# EAGLE design training_board (EAGLE 9.6.2)
AUTHOR: Varun Madabushi; REVISION: 0.1; SCH_DESC: Arduino Motor Shield for 2019-20 Training; TEAM: Electrical Training
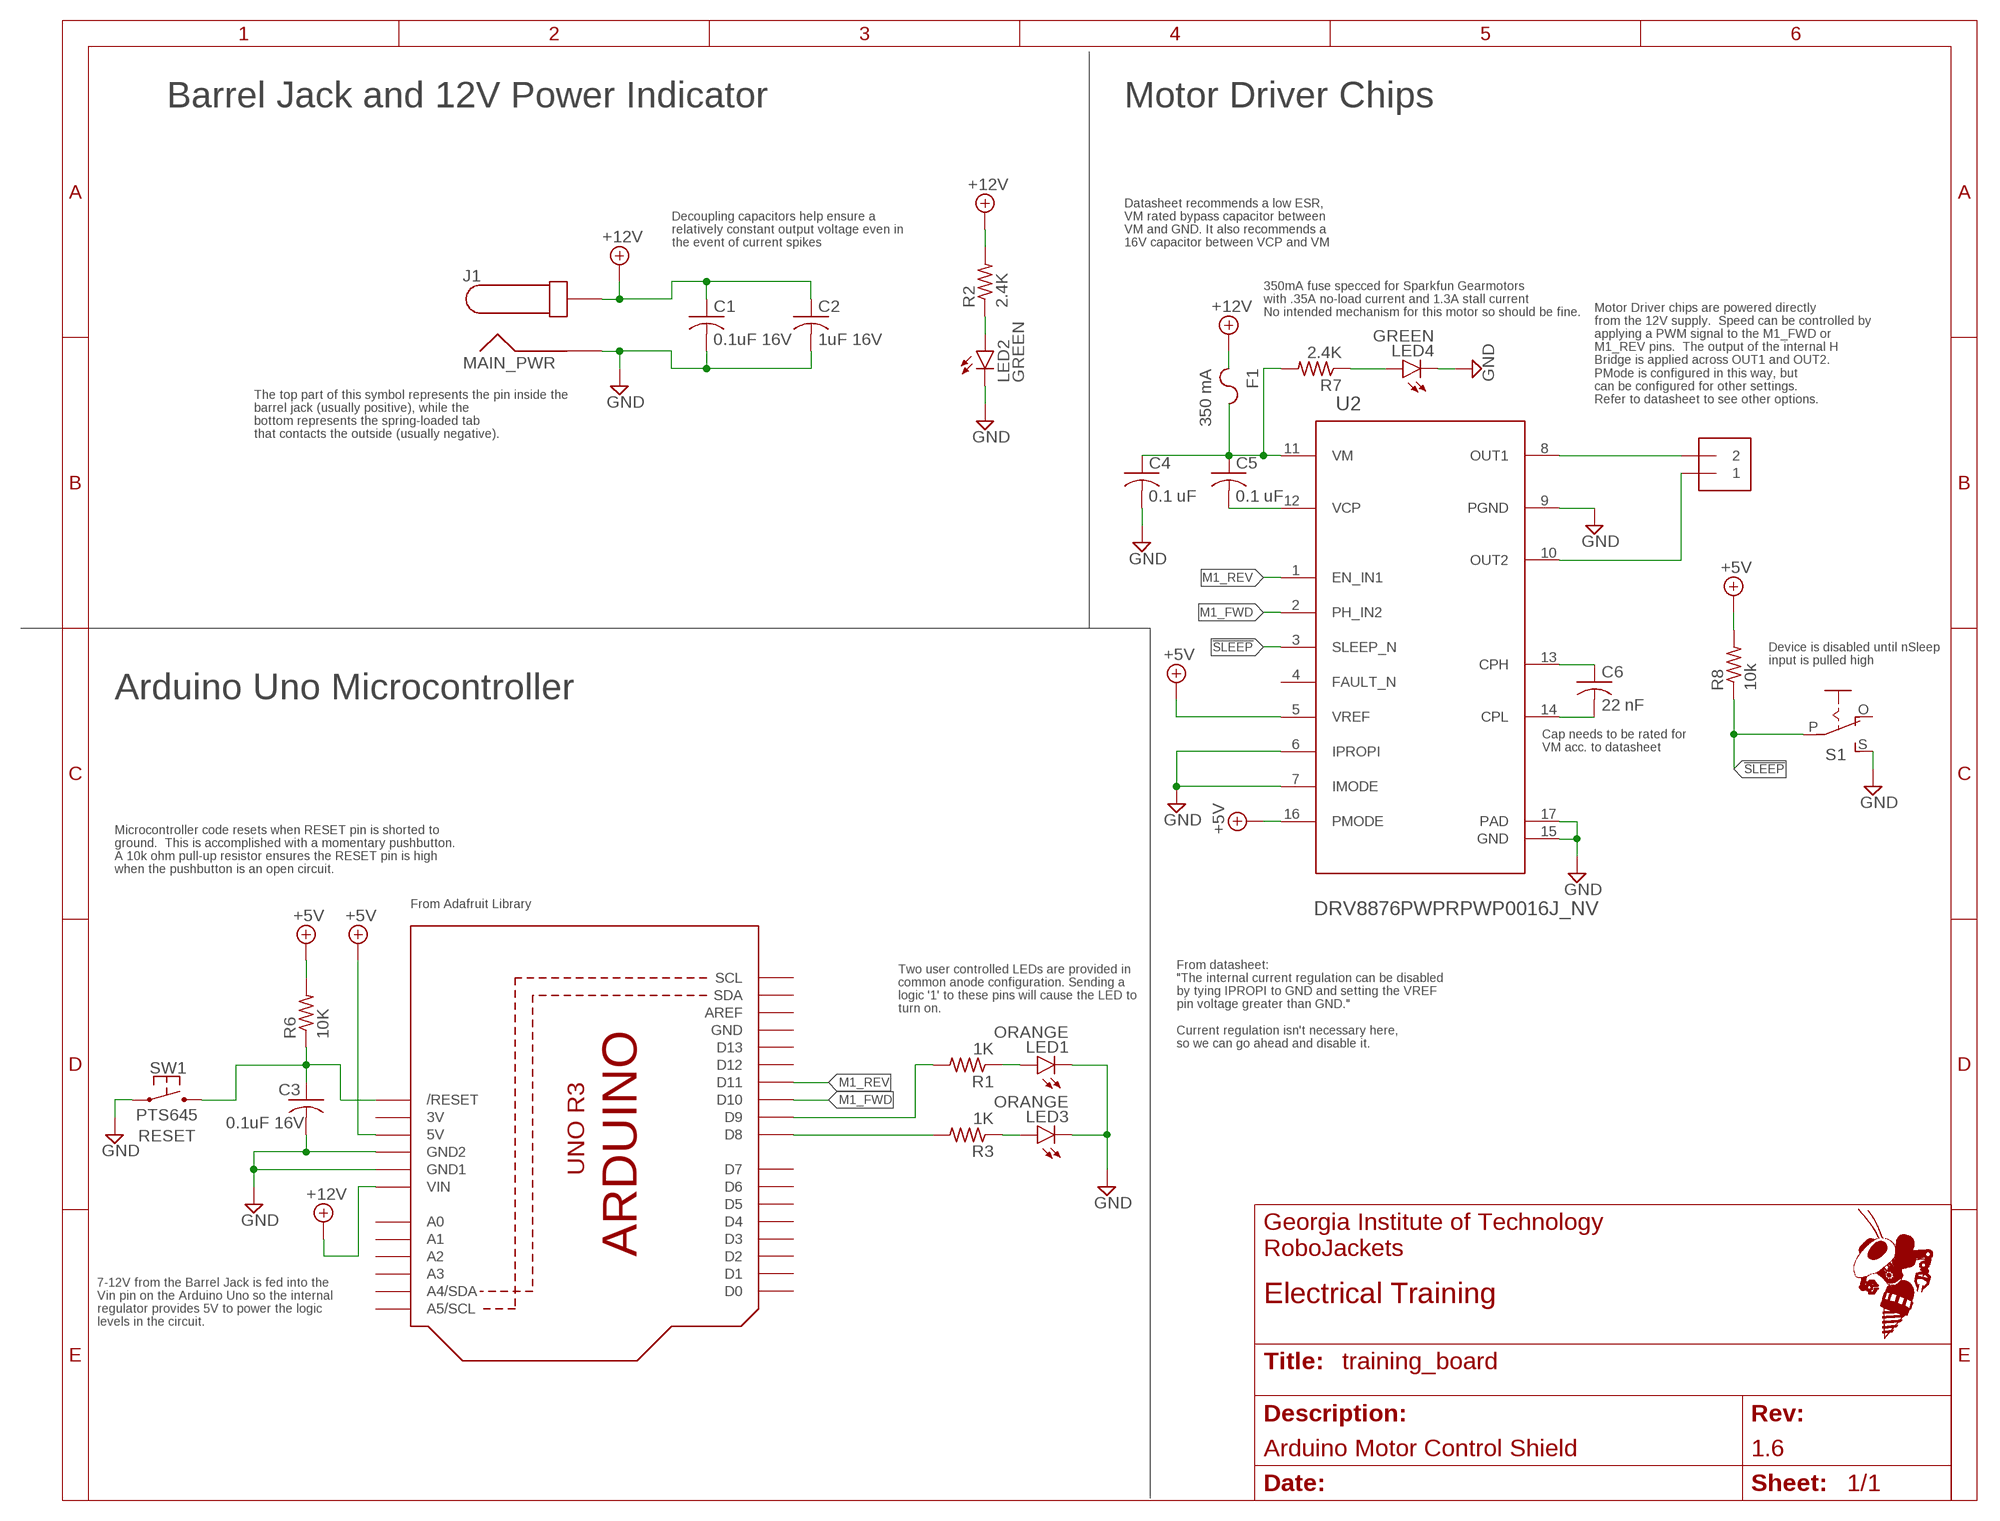
[diagram p0: schematic, sheet 1]
FRAME1 (FRAME_A_L): AUTHOR: Varun Madabushi; REVISION: 1.6; SCH_DESC: Arduino Motor Control Shield; TEAM: Electrical Training

## Parts
C1  0.1uF 16V  C-USC0805  [C0805]
C2  1uF 16V  C-USC0805  [C0805]
C3  0.1uF 16V  C-USC0805  [C0805]
C4  0.1 uF  C-US_CHIP-0603(1608-METRIC)  [CAPC1608X85]
C5  0.1 uF  C-US_CHIP-0603(1608-METRIC)  [CAPC1608X85]
C6  22 nF  C-US_CHIP-0603(1608-METRIC)  [CAPC1608X85]
F1  350 mA  CHIP_FUSE1812  [F1812]
J1  MAIN_PWR  PJ-037A  [PJ-037A]
LED1  ORANGE  LEDCHIP-LED0603  [CHIP-LED0603]
LED2  GREEN  LEDCHIP-LED0603  [CHIP-LED0603]
LED3  ORANGE  LEDCHIP-LED0603  [CHIP-LED0603]
LED4  GREEN  LEDCHIP-LED0603  [CHIP-LED0603]
OUT  1X2-3.5MM  [1X2-3.5MM]
Q2  ARDUINOR3-NOIOREF-NOTEXT  [ARDUINOR3-NOTEXT-NOIOREF]
R1  1K  R-US_R0603  [R0603]
R2  2.4K  R-US_R0603  [R0603]
R3  1K  R-US_R0603  [R0603]
R6  10K  R-US_R0603  [R0603]
R7  2.4K  R-US_R0603  [R0603]
R8  10k  R-US_R0603  [R0603]
S1  EG1903-ND  EG1218S  [EG1218]
SW1  PTS645  [PTS645]
U2  DRV8876PWPRPWP0016J_NV  [PWP0016J_NV]

## Nets
!SLEEP!: R8.1 S1.P U2.3(SLEEP_N)
+5V: Q2.5V R6.2 R8.2 U2.5(VREF) U2.16(PMODE)
+12V: C1.1 C2.1 F1.1 J1.P$2 Q2.VIN R2.2
CPH: C6.1 U2.13(CPH)
CPL: C6.2 U2.14(CPL)
GND: C1.2 C2.2 C3.2 C4.2 J1.P$1 LED1.C LED2.C LED3.C LED4.C Q2.GND1 Q2.GND2 S1.S SW1.1 SW1.2 U2.6(IPROPI) U2.7(IMODE) U2.9(PGND) U2.15(GND) U2.17(PAD)
M1_FWD: Q2.D10 U2.2(PH_IN2)
M1_REV: Q2.D11 U2.1(EN_IN1)
N$8: LED4.A R7.1
N$10: Q2.D9 R1.2
N$11: Q2.D8 R3.2
N$14: LED1.A R1.1
N$15: LED3.A R3.1
N$16: LED2.A R2.1
OUT1: OUT.2 U2.8(OUT1)
OUT2: OUT.1 U2.10(OUT2)
RESET: C3.1 Q2.RESET(/RESET) R6.1 SW1.3 SW1.4
VCP: C5.2 U2.12(VCP)
VM: C4.1 C5.1 F1.2 R7.2 U2.11(VM)
Unconnected: Q2.A0 Q2.A1 Q2.A2 Q2.A3 Q2.A4(A4/SDA) Q2.A5(A5/SCL) Q2.AREF Q2.D0 Q2.D1 Q2.D2 Q2.D3 Q2.D4 Q2.D5 Q2.D6 Q2.D7 Q2.D12 Q2.D13 Q2.SCL Q2.SDA S1.O U2.4(FAULT_N)

## Notes on the sheet
- Barrel Jack and 12V Power Indicator | Motor Driver Chips
- Decoupling capacitors help ensure a
  relatively constant output voltage even in
  the event of current spikes
- Datasheet recommends a low ESR, 
  VM rated bypass capacitor between
  VM and GND. It also recommends a 
  16V capacitor between VCP and VM
- 350mA fuse specced for Sparkfun Gearmotors
  with .35A no-load current and 1.3A stall current
  No intended mechanism for this motor so should be fine.
- Motor Driver chips are powered directly
  from the 12V supply.  Speed can be controlled by
  applying a PWM signal to the M1_FWD or
  M1_REV pins.  The output of the internal H
  Bridge is applied across OUT1 and OUT2.
  PMode is configured in this way, but
  can be configured for other settings.
  Refer to datasheet to see other options.
- The top part of this symbol represents the pin inside the 
  barrel jack (usually positive), while the
  bottom represents the spring-loaded tab
  that contacts the outside (usually negative).
- Device is disabled until nSleep
  input is pulled high
- Arduino Uno Microcontroller
- Cap needs to be rated for
  VM acc. to datasheet
- Microcontroller code resets when RESET pin is shorted to
  ground.  This is accomplished with a momentary pushbutton. 
  A 10k ohm pull-up resistor ensures the RESET pin is high
  when the pushbutton is an open circuit.
- From Adafruit Library
- Two user controlled LEDs are provided in 
  common anode configuration. Sending a 
  logic '1' to these pins will cause the LED to
  turn on.
- From datasheet:
  "The internal current regulation can be disabled 
  by tying IPROPI to GND and setting the VREF
  pin voltage greater than GND."
  
  Current regulation isn't necessary here, 
  so we can go ahead and disable it.
- 7-12V from the Barrel Jack is fed into the
  Vin pin on the Arduino Uno so the internal
  regulator provides 5V to power the logic 
  levels in the circuit.

## Power pins joined to a net without a drawn wire
3V: Q2.3V
GND: Q2.GND

## Library data of the parts
C1-C3 = rcl:C-US: CAPACITOR, American symbol; SPICEPREFIX: C
C4-C6 = Capacitor:C-US: Capacitor - ANSI; CATEGORY: Capacitor
F1 = RoboJackets-Fuses:CHIP_FUSE
J1 = RoboJackets-Connectors:PJ-037A
LED1-LED4 = led:LED: LED OSRAM: - CHIPLED LG R971, LG N971, LY N971, LG Q971, LY Q971, LO R971, LY R971 LH N974, LH R974 LS Q976, LO Q976, LY Q976 LO Q996 - Hyper CHIPLED LW Q18S LB Q993, LB Q99A, LB R99A - SideLED LS A670, LO A670, LY A670, LG A670, LP A670 LB A673, LV A673, LT A673, LW A673 LH A674 LY A675 LS A676, LA A676, LO A676, LY A676, LW A676 LS A679, LY A679, LG A679 - Hyper Micro SIDELED® LS Y876, LA Y876, LO Y876, LY Y876 LT Y87S - SmartLED LW L88C, LW L88S LB L89C, LB L89S, LG L890 LS L89K, LO L89K, LY L89K LS L896, LA L896, LO L896, LY L896 - TOPLED LS T670, LO T670, LY T670, LG T670, LP T670 LSG T670, LSP T670, LSY T670, LOP T670, LYG T670 LG T671, LOG T671, LSG T671 LB T673, LV T673, LT T673, LW T673 LH T674 LS T676, LA T676, LO T676, LY T676, LB T676, LH T676, LSB T676, LW T676 LB T67C, LV T67C, LT T67C, LS T67K, LO T67K, LY T67K, LW E67C LS E67B, LA E67B, LO E67B, LY E67B, LB E67C, LV E67C, LT E67C LW T67C LS T679, LY T679, LG T679 LS T770, LO T770, LY T770, LG T770, LP T770 LB T773, LV T773, LT T773, LW T773 LH T774 LS E675, LA E675, LY E675, LS T675 LS T776, LA T776, LO T776, LY T776, LB T776 LHGB T686 LT T68C, LB T68C - Hyper Mini TOPLED® LB M676 - Mini TOPLED Santana® LG M470 LS M47K, LO M47K, LY M47K Source: http://www.osram.convergy.de LUXEON: - LUMILED® LXK2-PW12-R00, LXK2-PW12-S00, LXK2-PW14-U00, LXK2-PW14-V00 LXK2-PM12-R00, LXK2-PM12-S00, LXK2-PM14-U00 LXK2-PE12-Q00, LXK2-PE12-R00, LXK2-PE12-S00, LXK2-PE14-T00, LXK2-PE14-U00 LXK2-PB12-K00, LXK2-PB12-L00, LXK2-PB12-M00, LXK2-PB14-N00, LXK2-PB14-P00, LXK2-PB14-Q00 LXK2-PR12-L00, LXK2-PR12-M00, LXK2-PR14-Q00, LXK2-PR14-R00 LXK2-PD12-Q00, LXK2-PD12-R00, LXK2-PD12-S00 LXK2-PH12-R00, LXK2-PH12-S00 LXK2-PL12-P00, LXK2-PL12-Q00, LXK2-PL12-R00 Source: www.luxeon.com KINGBRIGHT: KA-3528ASYC Source: www.kingbright.com
OUT = adafruit:1X2: 3.5mm Terminal block http://www.ladyada.net/library/pcb/eaglelibrary.html
Q2 = adafruit:ARDUINOR3-NOIOREF
R1-R3 R6-R8 = rcl:R-US_: RESISTOR, American symbol; SPICEPREFIX: R
S1 = adafruit:EG1218: SLIDING SWITCH 0.1" spacing through hole, vertical SPDT slide switch http://www.ladyada.net/library/pcb/eaglelibrary.html
SW1 = RoboJackets-Switches:PTS645; FUNCTION: RESET
U2 = RoboJackets-ICs:DRV8876PWPR; COPYRIGHT: Copyright (C) 2022 Ultra Librarian. All rights reserved.; MANUFACTURER_PART_NUMBER: DRV8876PWPR; MFR_NAME: Texas Instruments; REFDES: RefDes; TYPE: TYPE

## Board
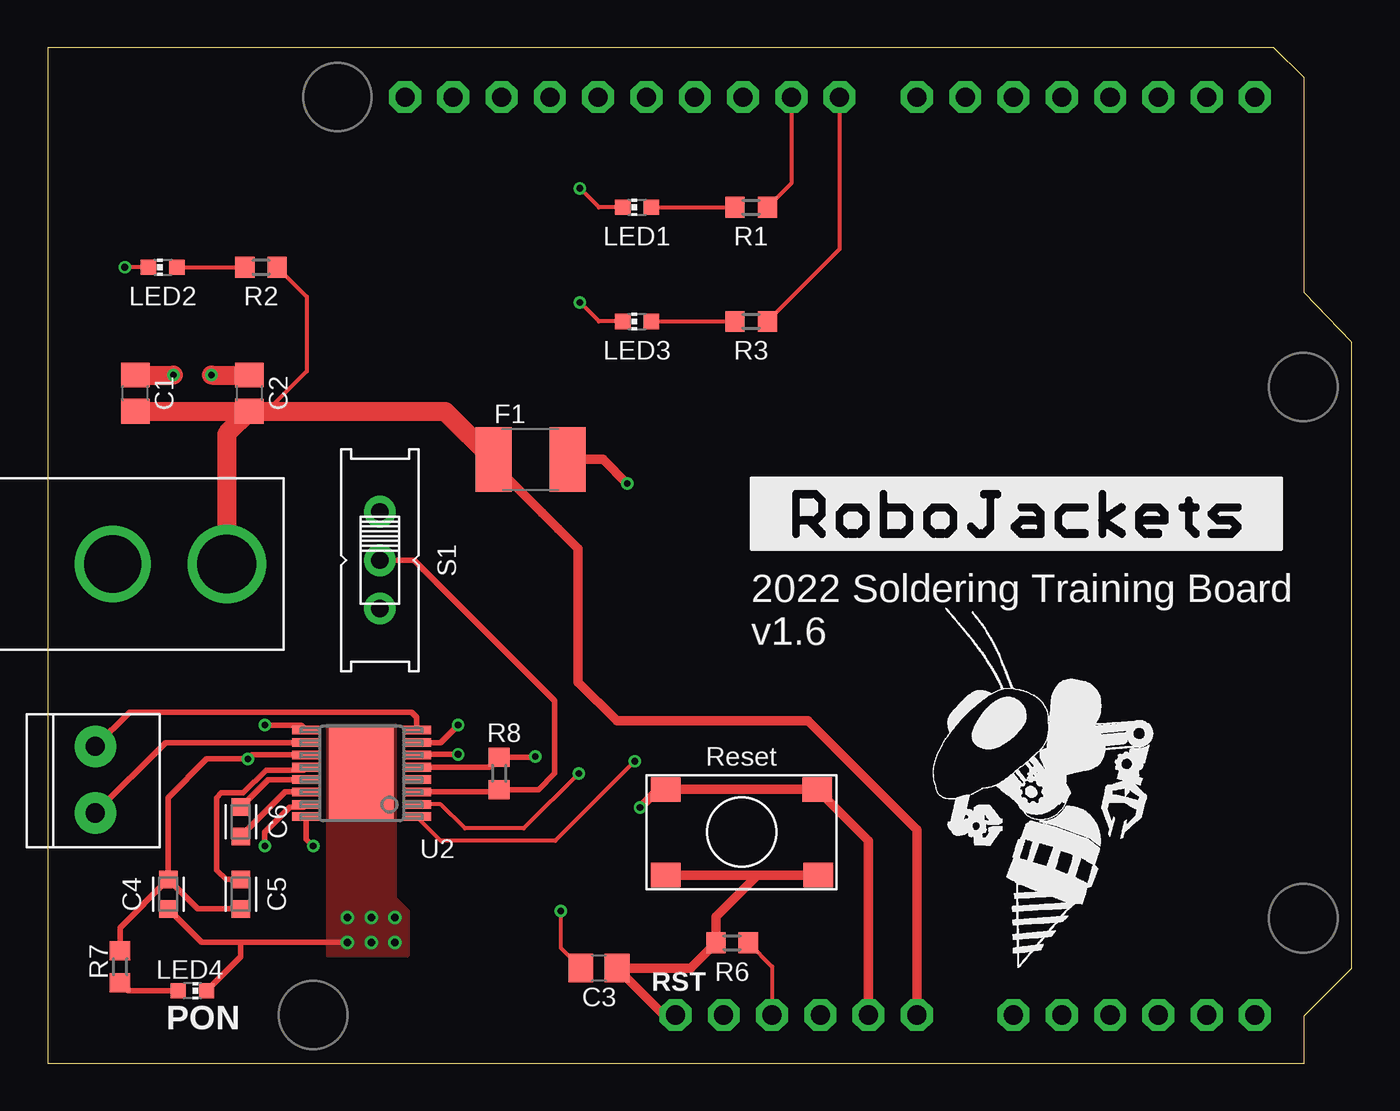
[diagram p1: board, top side]
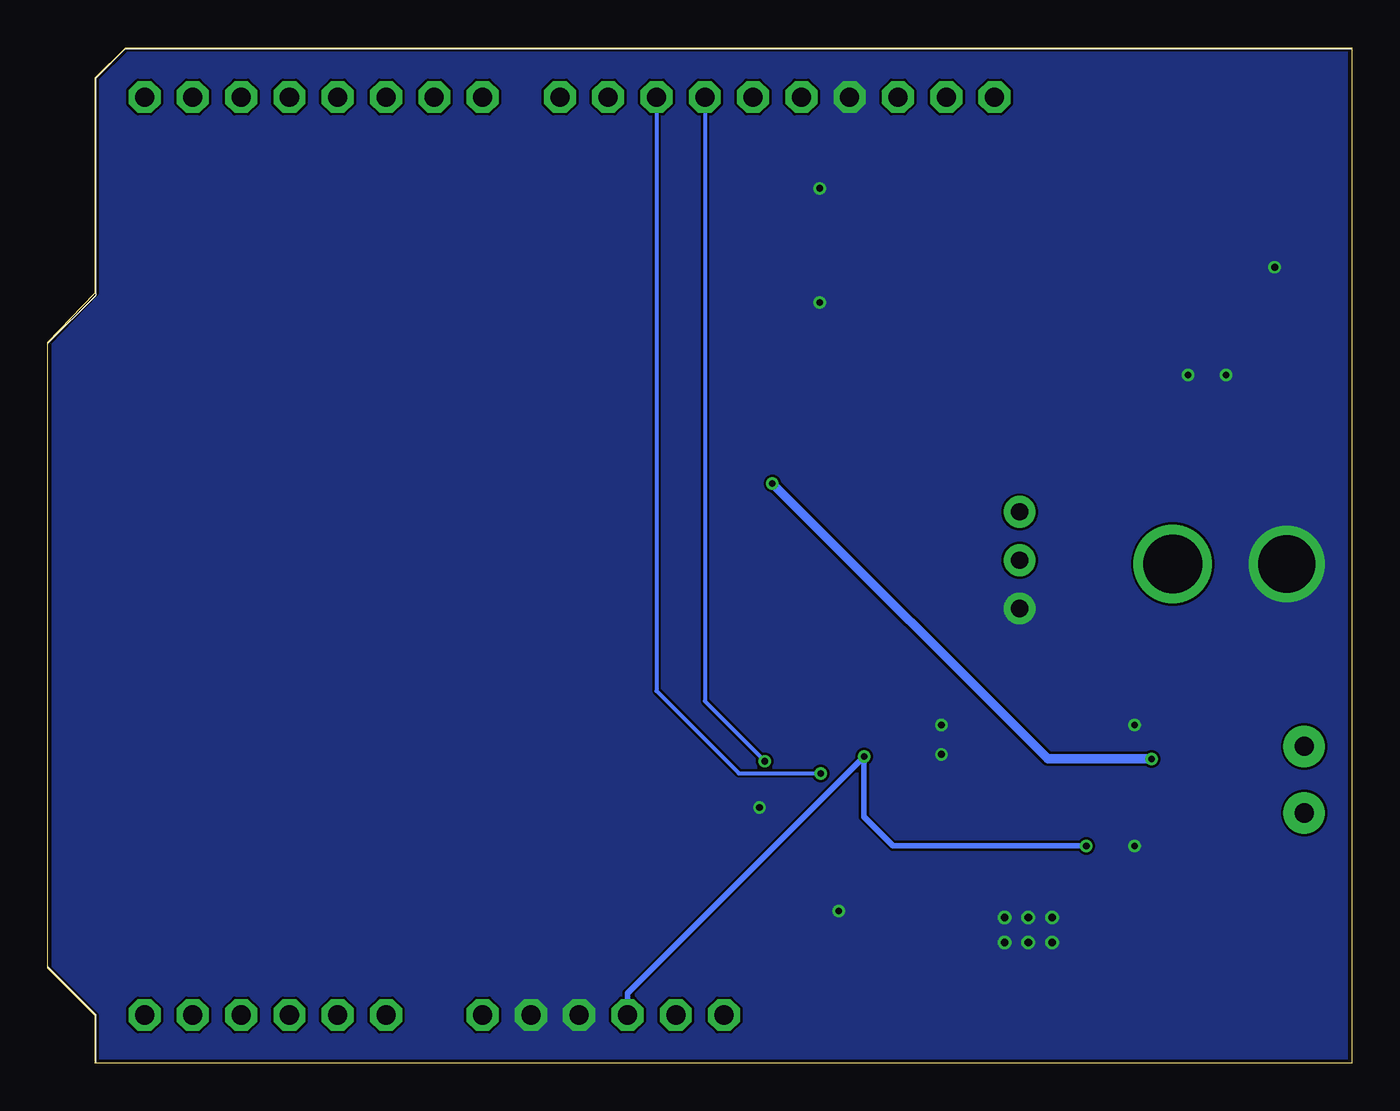
[diagram p2: board, bottom side, seen from below]

Size 68.6 x 53.4 mm. Coordinates in mm from the lower left corner, seen from the top.
Outline: 0,0 66.1,0 66.1,2.5 68.6,5 68.6,37.9 66.1,40.5 66.1,51.8 64.5,53.4 0,53.4 0,0
Copper layers (1+16): Top 0.035mm / dielectric 1.53mm / Bottom 0.035mm
Design rules "JLCPCB (2 Layer)": minimum track width 5mil, minimum drill 0.3mm, track to track 5mil, track to pad 5mil, pad to pad 5mil, via to via 20mil, smd to smd 5mil, copper to edge 0.2mm, drill to drill 21mil, minimum pad ring 6mil, minimum via ring 6mil, stop-mask expansion 6mil, vias tented up to drill 30mil, thermal gap 10mil

### Footprints (pad centres in the part's own frame; a part is rotated, then mirrored left to right if it is on the bottom)
C0805 = smd 1.3 x 1.5: 1 -0.95,0; 2 0.95,0
CAPC1608X85 = smd 0.921 x 0.97: 1 -0.775,0; 2 0.775,0
F1812 = smd 1.9 x 3.4: 1 -1.95,0; 2 1.95,0
PJ-037A = drill 3: P$1 0,0 | drill 3.1: P$2 6,0
CHIP-LED0603 = smd 0.8 x 0.8: A 0,-0.75; C 0,0.75
1X2-3.5MM = drill 1 pad 2.184: 1 1.8,0; 2 -1.7,0
ARDUINOR3-NOTEXT-NOIOREF = drill 1 pad 1.676 octagon: 3V 35.56,2.54; 5V 38.1,2.54; A0 50.8,2.54; A1 53.34,2.54; A2 55.88,2.54; A3 58.42,2.54; A4 60.96,2.54; A5 63.5,2.54; AREF 23.876,50.8; D0 63.5,50.8; D1 60.96,50.8; D2 58.42,50.8; D3 55.88,50.8; D4 53.34,50.8; D5 50.8,50.8; D6 48.26,50.8; D7 45.72,50.8; D8 41.656,50.8; D9 39.116,50.8; D10 36.576,50.8; D11 34.036,50.8; D12 31.496,50.8; D13 28.956,50.8; GND 26.416,50.8; GND1 43.18,2.54; GND2 40.64,2.54; RESET 33.02,2.54; SCL 18.796,50.8; SDA 21.336,50.8; VIN 45.72,2.54
R0603 = smd 1 x 1.1: 1 -0.85,0; 2 0.85,0
EG1218 = drill 0.9 pad 1.676: O -2.54,0; P 0,0; S 2.54,0
PTS645 = smd 1.55 x 1.3: 1 -3.975,2.25; 2 3.975,2.25; 3 -3.975,-2.25; 4 4.025,-2.25
PWP0016J_NV = smd 1.5 x 0.45: 1 -2.9,2.275; 2 -2.9,1.625; 3 -2.9,0.975; 4 -2.9,0.325; 5 -2.9,-0.325; 6 -2.9,-0.975; 7 -2.9,-1.625; 8 -2.9,-2.275; 9 2.9,-2.275; 10 2.9,-1.625; 11 2.9,-0.975; 12 2.9,-0.325; 13 2.9,0.325; 14 2.9,0.975; 15 2.9,1.625; 16 2.9,2.275 | smd 3.4 x 5: 17 0,0

### Placement (x,y rotation side)
C1  4.62,35.23 90 top
C2  10.62,35.23 90 top
C3  29,5 180 top
C4  6.35,8.89 270 top
C5  10.16,8.89 90 top
C6  10.16,12.7 270 top
F1  25.4,31.75 0 top
J1  3.43,26.25 0 top
LED1  31,45 90 top
LED2  6.06,41.85 90 top
LED3  31,39 90 top
LED4  7.62,3.81 270 top
OUT  2.51,14.96 270 top
Q2  0,0 0 top
R1  37,45 0 top
R2  11.23,41.85 0 top
R3  37,39 0 top
R6  36,6.33 0 top
R7  3.81,5.08 90 top
R8  23.75,15.24 90 top
S1  17.48,26.45 270 top
SW1  36.5,12.15 0 top
U2  16.51,15.24 180 top
U$1  [ROBOJACKETS]  37,27 0 top
U$2  [ROBOBUZZ_1.0X]  51,5 0 top

### Tracks (layer width: path | path; a pad name or v marks a point on that pad's centre or on a via)
!SLEEP!
  Top 0.3: U2.3 23.62,14.27 R8.1 25.82,14.39 26.67,15.24 26.67,19.05 19.27,26.45 S1.P
+5V  (via drill 0.35)
  Top 0.2: R6.2 38.1,5.08 Q2.5V
  Top 0.3: U2.16 13.61,11.79 v13.97,11.43 | v25.65,16.13 25.61,16.09 R8.2 23.22,15.56 U2.5
  Bottom 0.3: Q2.5V 38.1,3.68 v25.65,16.13 25.65,12.95 24.13,11.43 v13.97,11.43
+12V
  Top 0.2: C2.1 11.53,34.28 13.63,36.38 13.63,40.3 R2.2
  Top 0.5: Q2.VIN 45.72,12.28 40,18 29.95,18 27.91,20.04 27.91,27.04 26.84,28.11 26,28.95 23.45,31.5 F1.1
  Top 1: C1.1 C2.1 | C2.1 9.43,33.09 J1.P$2 | F1.1 20.92,34.28 C2.1
CPH
  Top 0.3: U2.13 11.6,14.91 C6.1
CPL
  Top 0.3: U2.14 12.5,14.27 C6.2
GND  (via drill 0.35, 0.4)
  Top 0.2: LED2.C v4.06,41.85 | LED1.C 29,45 v28,46 | LED3.C 29,39 v28,40 | C3.2 27,6.05 v27,8
  Top 0.3: U2.15 13.46,13.47 12.74,13.47 11.43,12.15 v11.43,11.43 | U2.9 13.35,17.78 v11.43,17.78 | C4.2 8.11,6.36 10.16,6.36 | 10.16,6.36 v15.77,6.36 | LED4.C 10.16,5.6 10.16,6.36 | U2.7 20.68,16.86 v21.59,17.78 | U2.6 19.44,16.25 v21.59,16.25
  Top 0.5: Q2.GND1 43.18,11.7 SW1.2 SW1.1 32.12,14.4 v31.16,13.44
  Top 1: C1.2 v6.62,36.18 | v8.62,36.18 C2.2
  other vias: 15.77,7.66 17.02,7.66 18.27,7.66 18.27,6.36 17.02,6.36
  pour Bottom (no thermals): 0,0 66.1,0 66.1,2.6 68.6,5.1 68.6,37.9 66.1,40.4 66.1,51.9 64.51,53.4 0,53.4
  pour Top (no thermals): 18.26,17.78 18.26,8.7 18.93,8.03 18.93,5.66 14.75,5.66 14.75,17.78
M1_FWD  (via drill 0.35)
  Top 0.2: v27.94,15.24 25.05,12.35 21.95,12.35 20.68,13.62 U2.2
  Bottom 0.2: Q2.D10 36.58,19.58 32.24,15.24 v27.94,15.24
M1_REV  (via drill 0.35)
  Top 0.2: v30.88,15.88 26.7,11.7 20.68,11.7 U2.1
  Bottom 0.2: Q2.D11 34.04,19.04 v30.88,15.88
N$8
  Top 0.3: R7.1 4.23,3.81 LED4.A
N$10
  Top 0.2: Q2.D9 39.12,46.27 R1.2
N$11
  Top 0.2: Q2.D8 41.66,42.81 R3.2
N$14
  Top 0.2: LED1.A R1.1
N$15
  Top 0.2: LED3.A R3.1
N$16
  Top 0.2: LED2.A R2.1
OUT1
  Top 0.3: OUT.2 4.31,18.46 19.15,18.46 19.41,18.2 U2.8
OUT2
  Top 0.3: U2.10 6.21,16.86 OUT.1
RESET
  Top 0.5: 37.34,9.9 SW1.3 | Q2.RESET 32.41,2.54 C3.1 33.82,5 R6.1 35.15,7.71 37.34,9.9 | SW1.4 37.34,9.9
VCP
  Top 0.3: C5.2 9.38,9.66 8.89,10.16 8.89,13.97 9.13,14.21 10.29,14.21 11.5,15.42 13.46,15.42 U2.12
VM  (via drill 0.35)
  Top 0.3: C4.1 6.35,13.97 8.38,16 v10.54,16 10.75,16.21 U2.11 | C5.1 7.9,8.12 C4.1 | C4.1 3.81,7.12 R7.2
  Top 0.5: F1.2 29.21,31.75 v30.48,30.48
  Bottom 0.5: v30.48,30.48 16,16 v10.54,16

### Text on the board
tPlace: 2022 Soldering Training Board | v1.6 | RST | PON
tNames: Reset
tValues: POWER | FUSE OK
tDocu: ON | OFF